# Altium schematic sheet Sheet1.SchDoc
size A; SheetNumber: 1; SheetTotal: 1
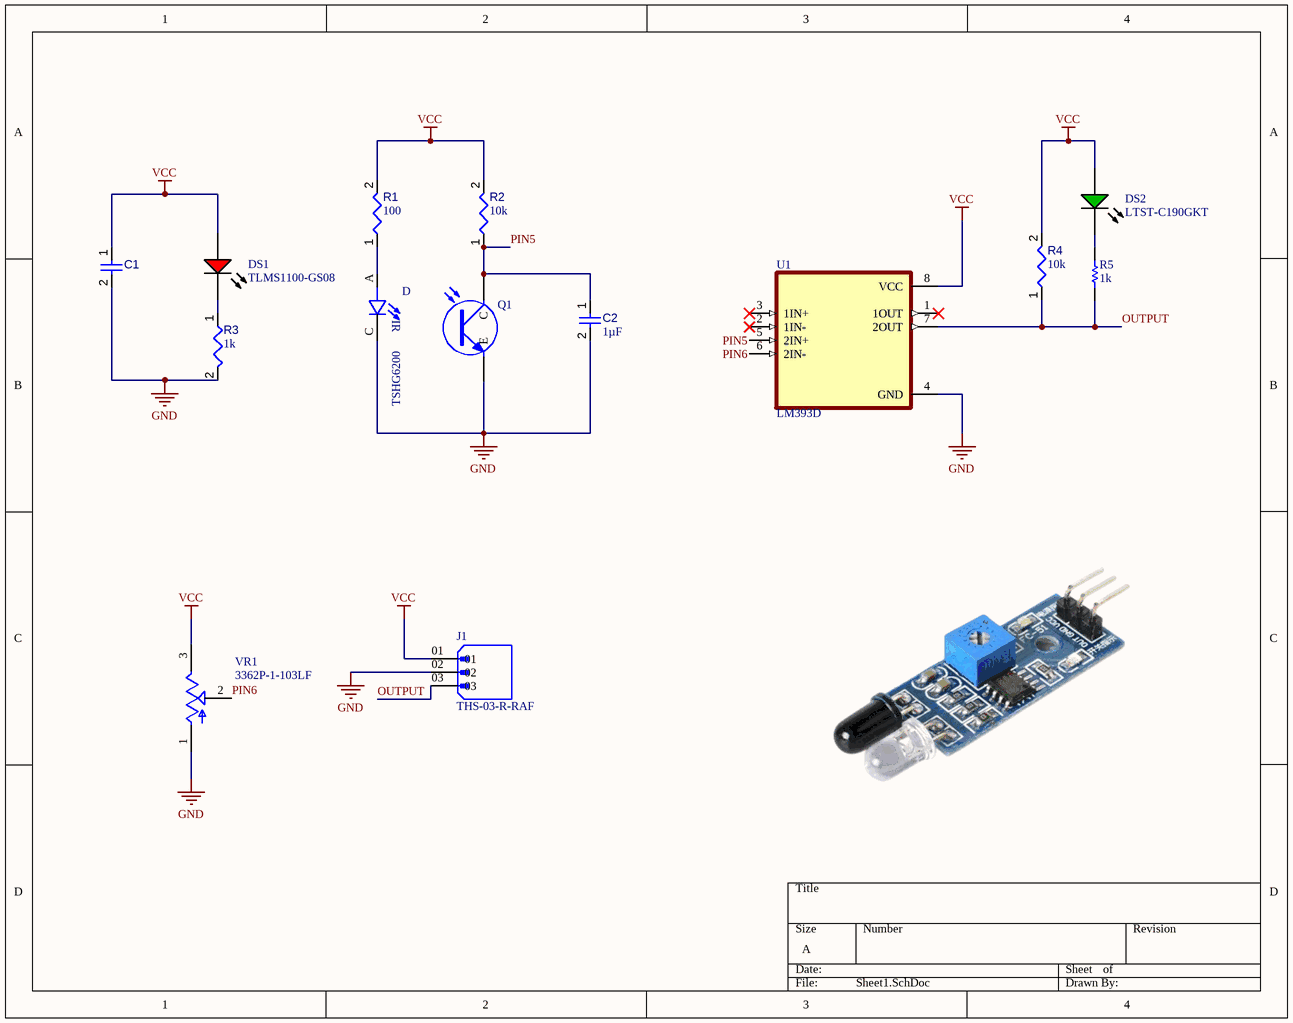
[diagram p0: Sheet1.SchDoc]

## Parts
C1  Capacitor 1 uF +/- 10% 25 V 0805  [CAPC2013X145X50ML20T25]  (value not drawn)
C2  value 1µF  [CAPC2013X145X50ML20T25]  (hidden comment: Capacitor 1 uF +/- 10% 25 V 0805)
D  TSHG6200  [LEDRD254W55D595H900]
DS1  TLMS1100-GS08  [VISH-TLMX1100_V]
DS2  LTST-C190GKT  [LTST-C190GKT_V]
J1  THS-03-R-RAF  [VALCON_THS-03-R-RAF]
Q1  1540051NC2590  [WL-TTRB_D5H8.7]  (value not drawn)
R1  value 100  [RESC0402(1005)_L]  (hidden comment: Resistor 100R +/-1 % 0402 63 mW)
R2  value 10k  [RESC1608X55X25ML10T15]  (hidden comment: Resistor 10k +/-1% 0603 100 mW)
R3  value 1k  [RESC0402(1005)_L]  (hidden comment: Resistor 1K +/-5 % 0402 63 mW)
R4  value 10k  [RESC1608X55X25ML10T15]  (hidden comment: Resistor 10k +/-1% 0603 100 mW)
R5  value 1k  [RESC1005X40X25ML05T05]  (hidden comment: Resistor 1k +/-1% 0402 100 mW)
U1  LM393D  [SOIC127P599X175-8N]
VR1  3362P-1-103LF  [TRIM_3362P-1-103LF]

## Nets
GND: C1.2 C2.2 D.C J1.02 Q1.2(E) R3.2 U1.4(GND) VR1.1(CCW)
VCC: C1.1 DS1.1(A) DS2.1(A) J1.01 R1.2 R2.2 R4.2 U1.8(VCC) VR1.3(CW)
OUTPUT: J1.03 R4.1 R5.1 U1.7(2OUT)
PIN5: C2.1 Q1.1(C) R2.1 U1.5(2IN+)
PIN6: U1.6(2IN-) VR1.2(WIPER)
NetD_A: D.A R1.1
NetDS1_2: DS1.2(K) R3.1
NetDS2_2: DS2.2(K) R5.2

Not connected (* = marked no-connect by the designer): U1 1(1OUT)* 2(1IN-)* 3(1IN+)*

## Notes on the sheet
- (in symbol TSHG6200) IR

## Library data of the parts
C1 = CMP-001-00010-6: Chip Capacitor, 1 uF, +/-10%, 25 V, 0805 (2012 Metric); Value: 1µF; Capacitor Type: Ceramic; Voltage Rating: 25V; RoHS Compliant: True; Pins: 2; Mounting Technology: SM; Max Operating Temperature: 125°C; Min Operating Temperature: -55°C; Tolerance: 10%; Case/Package: 0805
C2 = CMP-001-00010-6: Chip Capacitor, 1 uF, +/-10%, 25 V, 0805 (2012 Metric); Capacitor Type: Ceramic; Voltage Rating: 25V; RoHS Compliant: True; Pins: 2; Mounting Technology: SM; Max Operating Temperature: 125°C; Min Operating Temperature: -55°C; Tolerance: 10%; Case/Package: 0805
D = TSHG6200: Infrared Emitter 850nm 1800mW/sr Circular Top Mount 2-Pin T-1 3/4; MF: Vishay; MP: TSHG6200; Package: Radial Vishay; Mouser-Purchase-URL: https://snapeda.com/shop?store=Mouser&id=3623411; SnapEDA_Link: https://www.snapeda.com/parts/TSHG6200/Vishay/view-part/3623411/?ref=snap; Availability: Good; Price: None; Value: *; DigiKey-Purchase-URL: https://snapeda.com/shop?store=DigiKey&id=3623411; BuyPart: https://www.snapeda.com/parts/TSHG6200/Vishay/view-part/3623411/?ref=eda
DS1 = CMP-007-00030-2: Red Led, 20mA, 2.1 V, -40 to 100 degC, 2-Pin SMD (0603), RoHS, Tape and Reel; Manufacturer: Vishay Semiconductor; Viewing Angle: 160degrees; Forward Voltage: 2.1V; Lens Style: Clear; Power: 90mW; Luminous Intensity: 63mcd; Datasheet Version: Rev. 2.7, 03/2016; Package Quantity: 3000; Colour: Red; Package Description: 2-Pin Surface Mount Device, Body 1.6 x 0.8 mm; Datasheet URL: http://www.vishay.com/docs/83173/tlmb1100.pdf; Package Reference: TLMX1100; Max Operating Temperature: 100°C; Mounting Technology: SM; Packaging: TapeandReel; Case/Package: 0603; Illumination Colour: Red; Forward Current: 20mA; Manufacturer URL: http://www.vishay.com/; RoHS Compliant: True; Min Operating Temperature: -40°C; Nominal Vf: 2.1V; Pins: 2
DS2 = CMP-007-00022-2: LED Uni-Color Green, 100 mW, 30 mA, -55 to 85 degC, 2-Pin SMD, RoHS, Tape and Reel; Manufacturer: Lite-On; Power: 100mW; Forward Voltage: 2.1V; Viewing Angle: 130degrees; Forward Current: 20mA; Luminous Intensity: 6mcd; Lens Style: Clear; Manufacturer URL: http://www.us.liteon.com/; RoHS Compliant: True; Colour: Green; Package Description: 2-Pin Surface Mount Device, Body 1.6 x 0.8 mm; Datasheet URL: http://datasheet.octopart.com/LTST-C190GKT-Lite-On-datasheet-158530.pdf; Datasheet Version: Dec-06; Mounting Technology: SM; Case/Package: 0603; Package Reference: C190GKT; Packaging: TapeandReel; Min Operating Temperature: -55°C; Nominal Vf: 2.1V; Package Quantity: 3000; Illumination Colour: Green; Max Operating Temperature: 85°C; Pins: 2
Q1 = 1540051NC2590: WL-TTRB THT Phototransistor Round Black, D5H8.7mm, 700-1100nm, 1.5mA, 25°; Manufacturer: Wurth Elektronik; Chip Technology: Si; Collector Current Min: 10mA; Collector-Emitter Dark Current: 100nA; Polarity: NPN Phototransistor; Range of Spectral Bandwidth Min: 700nm; Range of Spectral Bandwidth Max: 1100nm; Wavelength of Peak Sensitivity: 940nm; ComponentLink1Description: Website Link; ComponentLink1URL: https://www.we-online.com/redexpert/article/1540051NC2590?ad; ComponentLink2Description: Datasheet Link; ComponentLink2URL: https://www.we-online.com/redexpert/spec/1540051NC2590?ad; Manufacturer Part Number: 1540051NC2590; Category: Phototransistors; Match Code: WL-TTRB; Mount: Through Hole; Operating Temperature Max: 85°C; Operating Temperature Min: -40°C; Packaging: Bulk; Height: 8.7mm; Diameter: 5mm; Collector Current: 1.5mA; Viewing Angle: 25°
R1 = CMP-009-00167-3: Chip Resistor, 100 Ohms, +/-1 %, 63 mW, -55 to 155 degC, 0402; Power: 63mW; Tolerance: 1%; Min Operating Temperature: -55°C; Case/Package: 0402; Pins: 2; Max Operating Temperature: 155°C
R2 R4 = CMP-009-00017-5: Chip Resistor, 10 KOhm, +/- 1%, 01 W, -55 to 155 degC, 0603 (1608 Metric); Voltage Rating: 50V; Power: 100mW; RoHS Compliant: True; Min Operating Temperature: -55°C; Pins: 2; Case/Package: 0603; Mounting Technology: SM; Max Operating Temperature: 155°C; Tolerance: 1%
R3 = CMP-009-00157-3: Chip Resistor, 1 kOhms, +/-5 %, 63 mW, -55 to 155 degC, 0402; Tolerance: 5%; Power: 63mW; Case/Package: 0402; Pins: 2; Min Operating Temperature: -55°C; Max Operating Temperature: 155°C
R5 = CMP-009-00009-5: Chip Resistor, 1 KOhm, +/- 1%, 0.1 W, -55 to 155 degC, 0402 (1005 Metric); Power: 100mW; Voltage Rating: 50V; Min Operating Temperature: -55°C; Max Operating Temperature: 155°C; RoHS Compliant: True; Mounting Technology: SM; Pins: 2; Tolerance: 1%; Case/Package: 0402
U1 = LM393D: Dual differential comparator, commercial grade; MF: Texas Instruments; Check_prices: https://www.snapeda.com/parts/LM393D/Texas+Instruments/view-part/?ref=eda; Value: *; Availability: In Stock; MP: LM393D; Price: None; Package: SOIC-8 Texas Instruments; SnapEDA_Link: https://www.snapeda.com/parts/LM393D/Texas+Instruments/view-part/?ref=snap; Purchase-URL: https://pricing.snapeda.com/search/part/LM393D/?ref=eda
VR1 = 3362P-1-103LF: 10 kOhms 0.5W, 1/2W PC Pins Through Hole Trimmer Potentiometer Cermet 1 Turn Top Adjustment; MF: Bourns; Check_prices: https://www.snapeda.com/parts/3362P-1-103LF/Bourns/view-part/13764/?ref=eda; Digi-Key_Part_Number: 3362P-103LF-ND; Value: *; Package: 3116 Bourns; SnapEDA_Link: https://www.snapeda.com/parts/3362P-1-103LF/Bourns/view-part/13764/?ref=snap; Purchase-URL: https://pricing.snapeda.com/search/part/3362P-1-103LF/?ref=eda; MP: 3362P-1-103LF
J1 = THS-03-R-RAF: Price: None; Package: None; Value: *; MP: THS-03-R-RAF; Availability: Unavailable